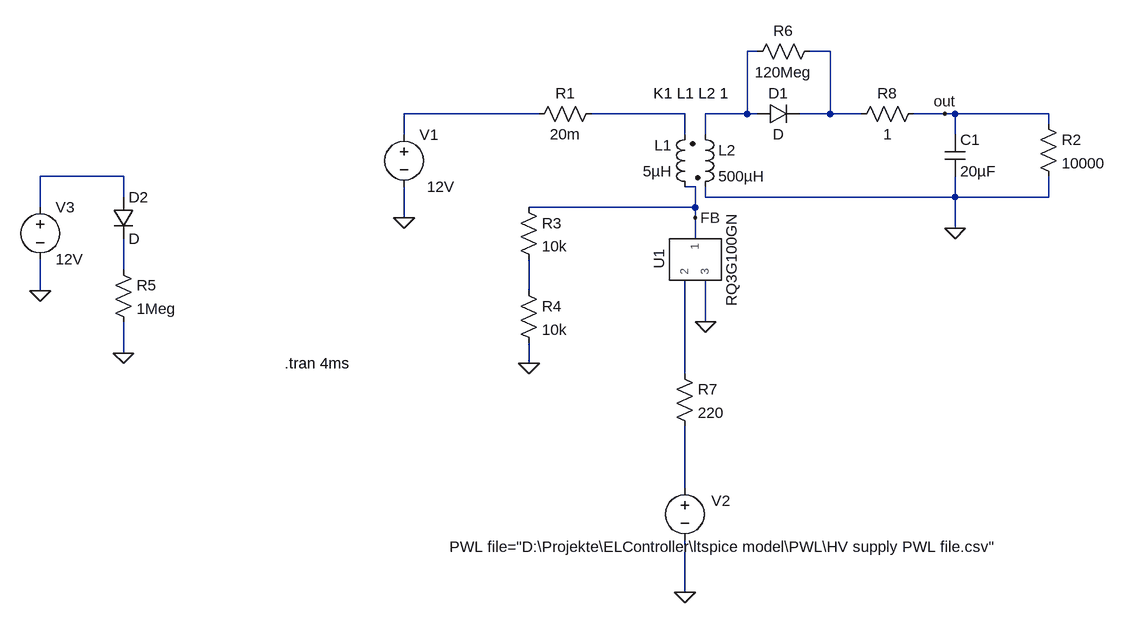
[diagram p0: schematic Flyback with output resistance.asc]
Flyback with output resistance.asc, the LTspice schematic file:
Version 4
SHEET 1 1040 868
WIRE 256 16 240 16
WIRE 368 16 336 16
WIRE -80 112 -288 112
WIRE 144 112 0 112
WIRE 240 112 240 16
WIRE 240 112 176 112
WIRE 256 112 240 112
WIRE 368 112 368 16
WIRE 368 112 320 112
WIRE 416 112 368 112
WIRE 544 112 496 112
WIRE 560 112 544 112
WIRE 704 112 560 112
WIRE 704 128 704 112
WIRE -288 144 -288 112
WIRE 144 144 144 112
WIRE 176 144 176 112
WIRE 560 144 560 112
WIRE -720 208 -848 208
WIRE 160 224 144 224
WIRE -720 240 -720 208
WIRE 176 240 176 224
WIRE 560 240 560 208
WIRE 560 240 176 240
WIRE 704 240 704 208
WIRE 704 240 560 240
WIRE -848 256 -848 208
WIRE 160 256 160 224
WIRE 160 256 -96 256
WIRE -288 272 -288 224
WIRE 160 272 160 256
WIRE 560 288 560 240
WIRE 160 304 160 272
WIRE -720 352 -720 304
WIRE -848 384 -848 336
WIRE -96 384 -96 336
WIRE 176 432 176 368
WIRE -720 480 -720 432
WIRE -96 496 -96 464
WIRE 144 512 144 368
WIRE 144 688 144 592
WIRE 144 848 144 768
FLAG -288 272 0
FLAG 176 432 0
FLAG 560 288 0
FLAG 544 112 out
FLAG 144 848 0
FLAG -96 496 0
FLAG 160 272 FB
FLAG -720 480 0
FLAG -848 384 0
SYMBOL ind2 160 240 R180
WINDOW 0 36 80 Left 2
WINDOW 3 36 40 Left 2
SYMATTR InstName L1
SYMATTR Value 5µH
SYMATTR Type ind
SYMBOL ind2 160 128 R0
SYMATTR InstName L2
SYMATTR Type ind
SYMATTR Value 500µH
SYMBOL diode 256 128 R270
WINDOW 0 32 32 VTop 2
WINDOW 3 0 32 VBottom 2
SYMATTR InstName D1
SYMBOL cap 544 144 R0
SYMATTR InstName C1
SYMATTR Value 20µF
SYMBOL voltage -288 128 R0
WINDOW 3 35 96 Left 2
WINDOW 123 0 0 Left 0
WINDOW 39 0 0 Left 0
SYMATTR Value 12V
SYMATTR InstName V1
SYMBOL voltage 144 672 R0
WINDOW 0 41 35 Left 2
WINDOW 3 -362 106 Left 2
WINDOW 123 0 0 Left 0
WINDOW 39 0 0 Left 0
SYMATTR InstName V2
SYMATTR Value PWL file="D:\Projekte\ELController\ltspice model\PWL\HV supply PWL file.csv"
SYMBOL res 688 112 R0
SYMATTR InstName R2
SYMATTR Value 10000
SYMBOL res 16 96 R90
WINDOW 0 0 56 VBottom 2
WINDOW 3 32 56 VTop 2
SYMATTR InstName R1
SYMATTR Value 20m
SYMBOL res -112 240 R0
SYMATTR InstName R3
SYMATTR Value 10k
SYMBOL res -112 368 R0
SYMATTR InstName R4
SYMATTR Value 10k
SYMBOL diode -736 240 R0
SYMATTR InstName D2
SYMBOL res -736 336 R0
SYMATTR InstName R5
SYMATTR Value 1Meg
SYMBOL voltage -848 240 R0
WINDOW 123 0 0 Left 0
WINDOW 39 0 0 Left 0
SYMATTR InstName V3
SYMATTR Value 12V
SYMBOL res 240 32 R270
WINDOW 0 32 56 VTop 2
WINDOW 3 0 56 VBottom 2
SYMATTR InstName R6
SYMATTR Value 120Meg
SYMBOL AutoGenerated\\RQ3G100GN 160 336 M90
SYMATTR InstName U1
SYMBOL res 128 496 R0
SYMATTR InstName R7
SYMATTR Value 220
SYMBOL res 512 96 R90
WINDOW 0 0 56 VBottom 2
WINDOW 3 32 56 VTop 2
SYMATTR InstName R8
SYMATTR Value 1
TEXT 96 80 Left 2 !K1 L1 L2 1
TEXT -472 496 Left 2 !.tran 4ms

The netlist it stands for:
* Flyback with output resistance.asc
L1 FB N004 5µH
L2 N001 0 500µH
D1 N001 N002 D
C1 out 0 20µF
V1 N003 0 12V
V2 N009 0 PWL file="D:\Projekte\ELController\ltspice model\PWL\HV supply PWL file.csv"
R2 out 0 10000
R1 N004 N003 20m
R3 FB N007 10k
R4 N007 0 10k
D2 N005 N006 D
R5 N006 0 1Meg
V3 N005 0 12V
R6 N001 N002 120Meg
XU1 FB N008 0 RQ3G100GN  ; pins 1 2 3
R7 N008 N009 220
R8 out N002 1
.model D D
.lib standard.dio
K1 L1 L2 1
.tran 4ms
.lib D:\Projekte\ELController\ltspice model\rq3g100gn_spice\rq3g100gn.lib
.backanno
.end